# Altium schematic sheet Unit.SchDoc
size A4
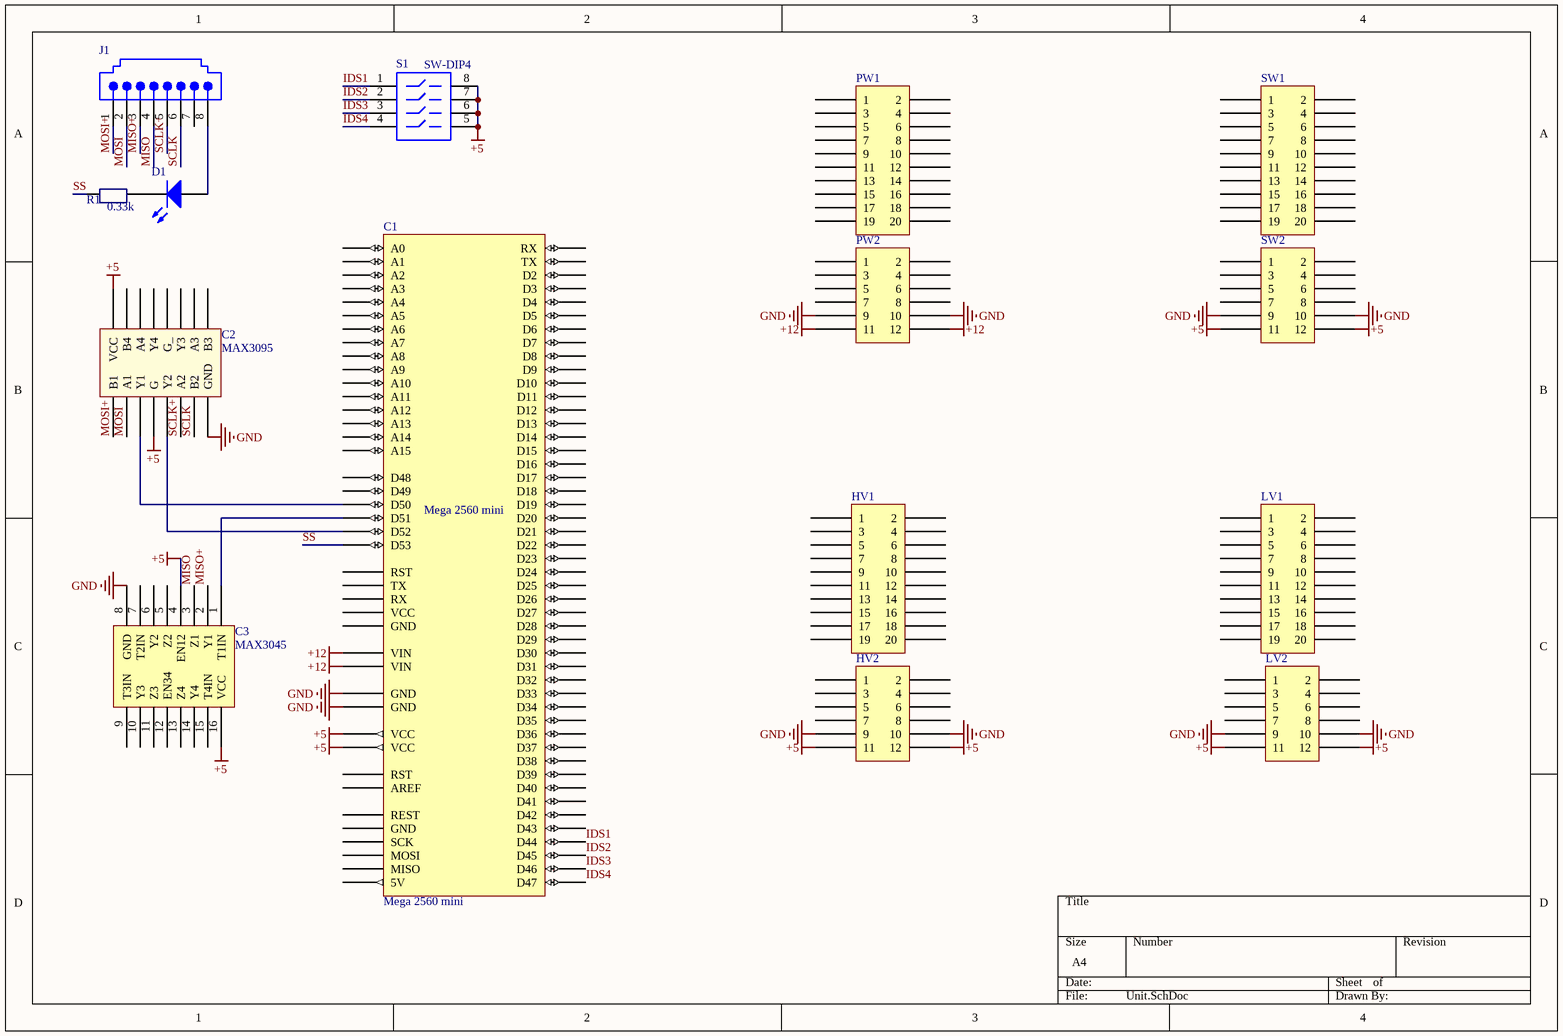
[diagram p0: Unit.SchDoc]

## Parts
C1  Mega 2560 mini  [Mega 2560 mini]
C2  MAX3095  [SOP16]
C3  MAX3045  [TSSOP-16]
D1  LED3  [3.5X2.8X1.9]  (value not drawn)
HV1  BTB-805-20P  [BTB-805-20P]  (value not drawn)
HV2  BTB-805-12P  [BTB-805-12P]  (value not drawn)
J1  15-43-6233  [15-43-6233]  (value not drawn)
LV1  BTB-805-20P  [BTB-805-20P]  (value not drawn)
LV2  BTB-805-12P  [BTB-805-12P]  (value not drawn)
PW1  BTB-805-20P  [BTB-805-20P]  (value not drawn)
PW2  BTB-805-12P  [BTB-805-12P]  (value not drawn)
R1  0.33k  [R0805]
S1  SW-DIP4  [DIP-8]
SW1  BTB-805-20P  [BTB-805-20P]  (value not drawn)
SW2  BTB-805-12P  [BTB-805-12P]  (value not drawn)

## Nets
 +5: C1.77(VCC) C1.78(VCC) C2.4(G) C2.16(VCC) C3.4(EN12) C3.16(VCC) HV2.11 HV2.12 LV2.11 LV2.12 S1.5 S1.6 S1.7 S1.8 SW2.11 SW2.12  [also labelled +5]
+12: C1.81(VIN) C1.82(VIN) PW2.11 PW2.12
GND: C1.79(GND) C1.80(GND) C2.8(GND) C3.8(GND) HV2.9 HV2.10 LV2.9 LV2.10 PW2.9 PW2.10 SW2.9 SW2.10
IDS1: C1.60(D44) S1.1
IDS2: C1.61(D45) S1.2
IDS3: C1.62(D46) S1.3
IDS4: C1.63(D47) S1.4
MISO: C3.3(Z1) J1.4
MISO+: C3.2(Y1) J1.3
MOSI: C2.2(A1) J1.2
MOSI+: C2.1(B1) J1.1
SCLK: C2.7(B2) J1.6
SCLK+: C2.6(A2) J1.5
SS: C1.88(D53) R1.1
NetC1_85: C1.85(D50) C2.3(Y1)
NetC1_86: C1.86(D51) C3.1(T1IN)
NetC1_87: C1.87(D52) C2.5(Y2)
NetD1_1: D1.1(A) J1.8
NetD1_2: D1.2(K) R1.2

Not connected (* = marked no-connect by the designer): C1 0(A0) 1(A1) 2(A2) 3(A3) 4(A4) 5(A5) 6(A6) 7(A7) 8(A8) 9(A9) 10(A10) 11(A11) 12(A12) 13(A13) 14(A14) 15(A15) 16(RX) 17(TX) 18(D2) 19(D3) 20(D4) 21(D5) 22(D6) 23(D7) 24(D8) 25(D9) 26(D10) 27(D11) 28(D12) 29(D13) 30(D14) 31(D15) 32(D16) 33(D17) 34(D18) 35(D19) 36(D20) 37(D21) 38(D22) 39(D23) 40(D24) 41(D25) 42(D26) 43(D27) 44(D28) 45(D29) 46(D30) 47(D31) 48(D32) 49(D33) 50(D34) 51(D35) 52(D36) 53(D37) 54(D38) 55(D39) 56(D40) 57(D41) 58(D42) 59(D43) 64(RST) 65(TX) 66(RX) 67(VCC) 68(GND) 69(5V) 70(MISO) 71(MOSI) 72(SCK) 73(GND) 74(REST) 75(AREF) 76(RST) 83(D48) 84(D49); C2 9(B3) 10(A3) 11(Y3) 12(G_) 13(Y4) 14(A4) 15(B4); C3 5(Z2) 6(Y2) 7(T2IN) 9(T3IN) 10(Y3) 11(Z3) 12(EN34) 13(Z4) 14(Y4) 15(T4IN); HV1 1 2 3 4 5 6 7 8 9 10 11 12 13 14 15 16 17 18 19 20; HV2 1 2 3 4 5 6 7 8; J1 7; LV1 1 2 3 4 5 6 7 8 9 10 11 12 13 14 15 16 17 18 19 20; LV2 1 2 3 4 5 6 7 8; PW1 1 2 3 4 5 6 7 8 9 10 11 12 13 14 15 16 17 18 19 20; PW2 1 2 3 4 5 6 7 8; SW1 1 2 3 4 5 6 7 8 9 10 11 12 13 14 15 16 17 18 19 20; SW2 1 2 3 4 5 6 7 8

## Library data of the parts
D1 = LED3: Typical BLUE SiC LED; Published: 8-Jun-2000; LatestRevisionDate: 17-Dec-2003; LatestRevisionNote: PCB Footprint replaced.; DatasheetVersion: 16-Apr-2002; PackageVersion: 16-Apr-2002; PackageReference: 3.5X2.8X1.9; Publisher: Altium Limited; PackageDescription: SM LED; 2 C-Bend Leads; Body 3.5 x 2.8 x 1.9 mm, inc leads (LxWxH typ)
J1 = 15-43-6233: Right Angle, Standard Profile, RJ45-Keyed, Flange Mount PCB Jack; Ports: 1; Positions/Loaded: Port1 - 8 Keyed/8; PerformanceCategory: 3; PCB_Mounting: Thru-Hole; ComponentAvailability: Obsolete; DrillSize: Nominal, Rounded to nearest 0.05mm; PCB_Layout: Complies with Manufacturer's Recommendation.; Published: 25-Jun-2002; DatasheetDocument: 18-Dec-2001; PackageDocument: 18-Dec-2001; PackageReference: 15-43-6233; Publisher: Altium Limited; ComponentLink1Description: Manufacturer Link; ComponentLink1URL: http://www.molex.com/; ComponentLink2Description: Datasheet; ComponentLink2URL: http://www.molex.com/cmc_upload/common_files/1212003_catalogmx41314.pdf; ComponentLink3Description: Iges Model; ComponentLink3URL: http://www.molex.com/pdm_docs/igs/15-43-6233_igs.zip
R1 = Resistance
S1 = SW-DIP4: DIP Switch; Published: 24-Mar-1999; LatestRevisionDate: 17-Jul-2002; LatestRevisionNote: Re-released for DXP Platform.; PackageReference: DIP-8; Publisher: Altium Limited